# Altium schematic sheet STM32F401.SchDoc
size A; SheetNumber: 1; SheetTotal: 4
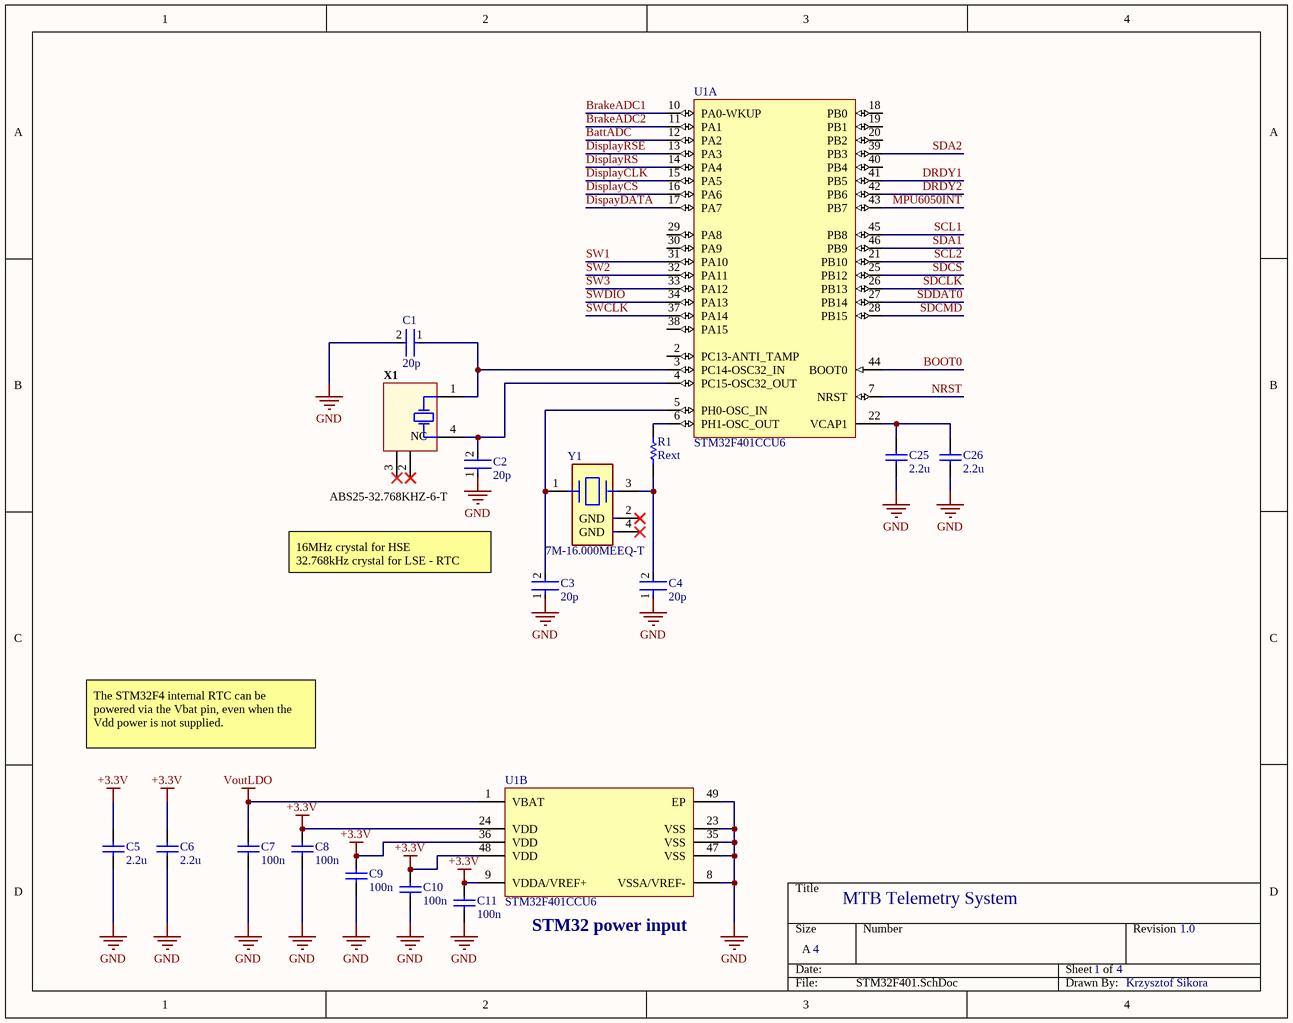
[diagram p0: STM32F401.SchDoc]

## Parts
C1  20p  [FP-C0603C-CF-MFG]
C2  20p  [FP-C0603C-CF-MFG]
C3  20p  [FP-C0603C-CF-MFG]
C4  20p  [FP-C0603C-CF-MFG]
C5  2.2u  [CAPC2013X88X50LL20T25]
C6  2.2u  [CAPC2013X88X50LL20T25]
C7  100n  [CAPC2013X88X50LL20T25]
C8  100n  [CAPC2013X88X50LL20T25]
C9  100n  [CAPC2013X88X50LL20T25]
C10  100n  [CAPC2013X88X50LL20T25]
C11  100n  [CAPC2013X88X50LL20T25]
C25  2.2u  [CAPC2013X88X50LL20T25]
C26  2.2u  [CAPC2013X88X50LL20T25]
R1  Rext  [RESC1609X50X30NL8T20]
U1  STM32F401CCU6  [STM-UFQFPN48_N]  (parts A,B of 2)
X1  ABS25-32.768KHZ-6-T  [ABRA-ABS25-4_V]
Y1  7M-16.000MEEQ-T  [FP-7M-MFG]

## Nets
+3.3V: C5.2 C6.2 C8.2 C9.2 C10.2 C11.2 U1.9(VDDA/VREF+) U1.24(VDD) U1.36(VDD) U1.48(VDD)
GND: C1.2 C2.1 C3.1 C4.1 C5.1 C6.1 C7.1 C8.1 C9.1 C10.1 C11.1 C25.1 C26.1 U1.8(VSSA/VREF-) U1.23(VSS) U1.35(VSS) U1.47(VSS) U1.49(EP)
VoutLDO: C7.2 U1.1(VBAT)
BattADC: U1.12(PA2)
BOOT0: U1.44(BOOT0)
BrakeADC1: U1.10(PA0-WKUP)
BrakeADC2: U1.11(PA1)
DispayDATA: U1.17(PA7)
DisplayCLK: U1.15(PA5)
DisplayCS: U1.16(PA6)
DisplayRS: U1.14(PA4)
DisplayRSE: U1.13(PA3)
DRDY1: U1.41(PB5)
DRDY2: U1.42(PB6)
MPU6050INT: U1.43(PB7)
NRST: U1.7(NRST)
SCL1: U1.45(PB8)
SCL2: U1.21(PB10)
SDA1: U1.46(PB9)
SDA2: U1.39(PB3)
SDCLK: U1.26(PB13)
SDCMD: U1.28(PB15)
SDCS: U1.25(PB12)
SDDAT0: U1.27(PB14)
SW1: U1.31(PA10)
SW2: U1.32(PA11)
SW3: U1.33(PA12)
SWCLK: U1.37(PA14)
SWDIO: U1.34(PA13)
NetC1_1: C1.1 U1.3(PC14-OSC32_IN) X1.1(X1)
NetC2_2: C2.2 U1.4(PC15-OSC32_OUT) X1.4(X2)
NetC3_2: C3.2 U1.5(PH0-OSC_IN) Y1.1
NetC4_2: C4.2 R1.1 Y1.3
NetC25_2: C25.2 C26.2 U1.22(VCAP1)
NetR1_2: R1.2 U1.6(PH1-OSC_OUT)

Not connected (* = marked no-connect by the designer): U1 2(PC13-ANTI_TAMP) 18(PB0) 19(PB1) 20(PB2) 29(PA8) 30(PA9) 38(PA15) 40(PB4); X1 2(NC)* 3(NC)*; Y1 2(GND)* 4(GND)*

## Notes on the sheet
- 16MHz crystal for HSE
  32.768kHz crystal for LSE - RTC
- The STM32F4 internal RTC can be powered via the Vbat pin, even when the Vdd power is not supplied.
- MTB Telemetry System
- (near U1) STM32 power input
- 4
- 1
- 1.0
- Krzysztof Sikora

## Library data of the parts
C1-C4 = CMP-2006-03061-2: CAP CER 0.1UF 50V X7R 0603; Manufacturer: KEMET; Manufacturer Part Number: C0603C104K5RACTU; Tolerance: 0.1; Temperature Coefficient: 30ppm/°C; Material: Ceramic; Automotive Grade: Grade 1; Value: 0.10 μF; Temperature: -55°C to +125°C; RoHS: TRUE; Temperature Range High: +125°C; Lead Free: Yes; Octopart: https://octopart.com/c0603c104k5ractu-kemet-139244; Digikey Description: CAP CER 0.1UF 50V X7R 0603; Category: Cap; Package: C0603C-CF; ComponentLink2Description: Datasheet; Temperature Range Low: -55°C; Device Class L1: Passive Components; Voltage Rating: 50 V; Automotive: Yes; Device Class L3: Ceramic Capacitors; ComponentLink2URL: https://api.kemet.com/component-edge/download/datasheet/C0603C100J5GACAUTO.pdf; Capacitance: 0.10 μF; Device Class L2: Capacitors; Temperature Characteristic: X7R; Height: 0.87mm
C5-C11 C25 C26 = CMP-2007-00266-1: Manufacturer: Kemet; Part Number: C0805C103K5RACTU
R1 = CMP-1666-00005-4: Chip Resistor, 10 KOhm, +/- 1%, 100 mW, -55 to 155 degC, 0603 (1608 Metric), RoHS, Tape and Reel; Manufacturer: Vishay Semiconductor; Voltage Rating: 75 V; Max Operating Temperature: 155 degC; PackageDescription: 2-Pin Surface Mount Device, Body 1.575 x 0.85 mm; ComponentLink1Description: Manufacturer URL; RoHSCompliant: true; PackageReference: 0603; REACH SVHC: Unknown; Length: 1.55 mm; DatasheetVersion: 06/2012; Packaging: Tape and Reel; Min Operating Temperature: -55 degC; Mounting Technology: Surface Mount; ComponentLink2URL: https://datasheet.ciiva.com/11809/0900766b80d98afc-11809037.pdf; Height: 0.45 mm; ComponentLink2Description: Datasheet; Package Quantity: 5000; ComponentLink1URL: http://www.vishay.com/
U1 = CMP-0243-00119-2: ARM Cortex-M4 32-bit MCU+FPU, 105 DMIPS, 256 kB Flash, 64 kB Internal RAM, 36 I/Os, 48-pin UFQFPN, -40 to 85 degC, Tray; Manufacturer: STMicroelectronics; Supply Voltage(Vcc) max (V): 3.6; I/Os (High Current): 36; Internal RAM Size (kB): 64; Operating Frequency(F) (Processor speed) (MHz): 84; FLASH Size (Prog) (kB): 256; Supply Voltage(Vcc) min (V): 1.8; Packing: Tray; PackageReference: UFQFPN48; PackageVersion: Rev. 1, 04/2013; Core: ARM Cortex-M4; ComponentLink1Description: Manufacturer URL; ComponentLink3Description: Package Specification; PackageDescription: 48-Pin Ultra Thin Fine Pitch Quad Flat No-Lead, 7 x 7 x 0.6 mm Body, 0.5 mm Pitch, Exposed Pad; Mounting Technology: Surface Mount; ComponentLink2URL: http://www.st.com/st-web-ui/static/active/en/resource/technical/document/data_brief/DM00071938.pdf; DatasheetVersion: Rev. 1; ComponentLink2Description: Datasheet; ComponentLink1URL: http://www.st.com/web/en/home.html; PartNumber: STM32F401CCU6; ComponentLink3URL: http://www.st.com/st-web-ui/static/active/en/resource/technical/document/data_brief/DM00071938.pdf
X1 = CMP-2000-05036-1: Low Frequency Crystal, 32.768 KHz, 6 pF, +/- 20 ppm, -40 to 85 degC, 4-Pin SMD, RoHS, Tape and Reel; Manufacturer: Abracon; Tolerance: 20PPM; ESR: 50kOhms; Case Width: 3.8mm; Case Height: 2.5mm; Case Length: 8mm; Load Capacitance: 6pF; Operating Temperature Range: -40Cto+85C; Package Reference: ABS25; Factory Pack Quantity: 3000; Package Description: 4-Pin Surface Mount Device, Body 8 x 3.8 mm, Pitch 5.5 mm; Frequency: 32.768kHz; Termination Style: SMD/SMT; Manufacturer URL: http://www.abracon.com/; Type: LowFrequencyCrystal; Dimensions: 3.8mmWx8mmLx2.5mmH; Product Category: Crystals; Series: ABS25; RoHS: Details; Package / Case: 8mmx3.8mm; Datasheet Version: Jun-17; Brand: ABRACON; Datasheet URL: https://datasheet.ciiva.com/854/abs25-854528.pdf; Packaging: Reel; Mounting Style: SMD/SMT
Y1 = CMP-18717-000438-1: Crystal 16MHz, 10ppm, 10pF, 60Ω; ESR (Equivalent Series Resistance): 100R; Width: 2.5mm; REACH SVHC: No SVHC; Mount: Surface Mount; Package Quantity: 1; Depth: 2.5mm; Frequency Tolerance: 10ppm; Length: 3.2mm; Packaging: Tape and Reel; Termination: SMD/SMT; RoHS Compliant: Yes; Max Operating Temperature: 70°C; Min Operating Temperature: -10°C; Tolerance: 10ppm; Frequency Stability: 10ppm; Series: 7M; Height: 0.031inch; Number of Pins: 4; Load Capacitance: 10pF; Frequency: 16MHz; Case/Package: SMD/SMT